# EAGLE design vdg_voltage_sensor_rev2 (EAGLE 9.6.2)
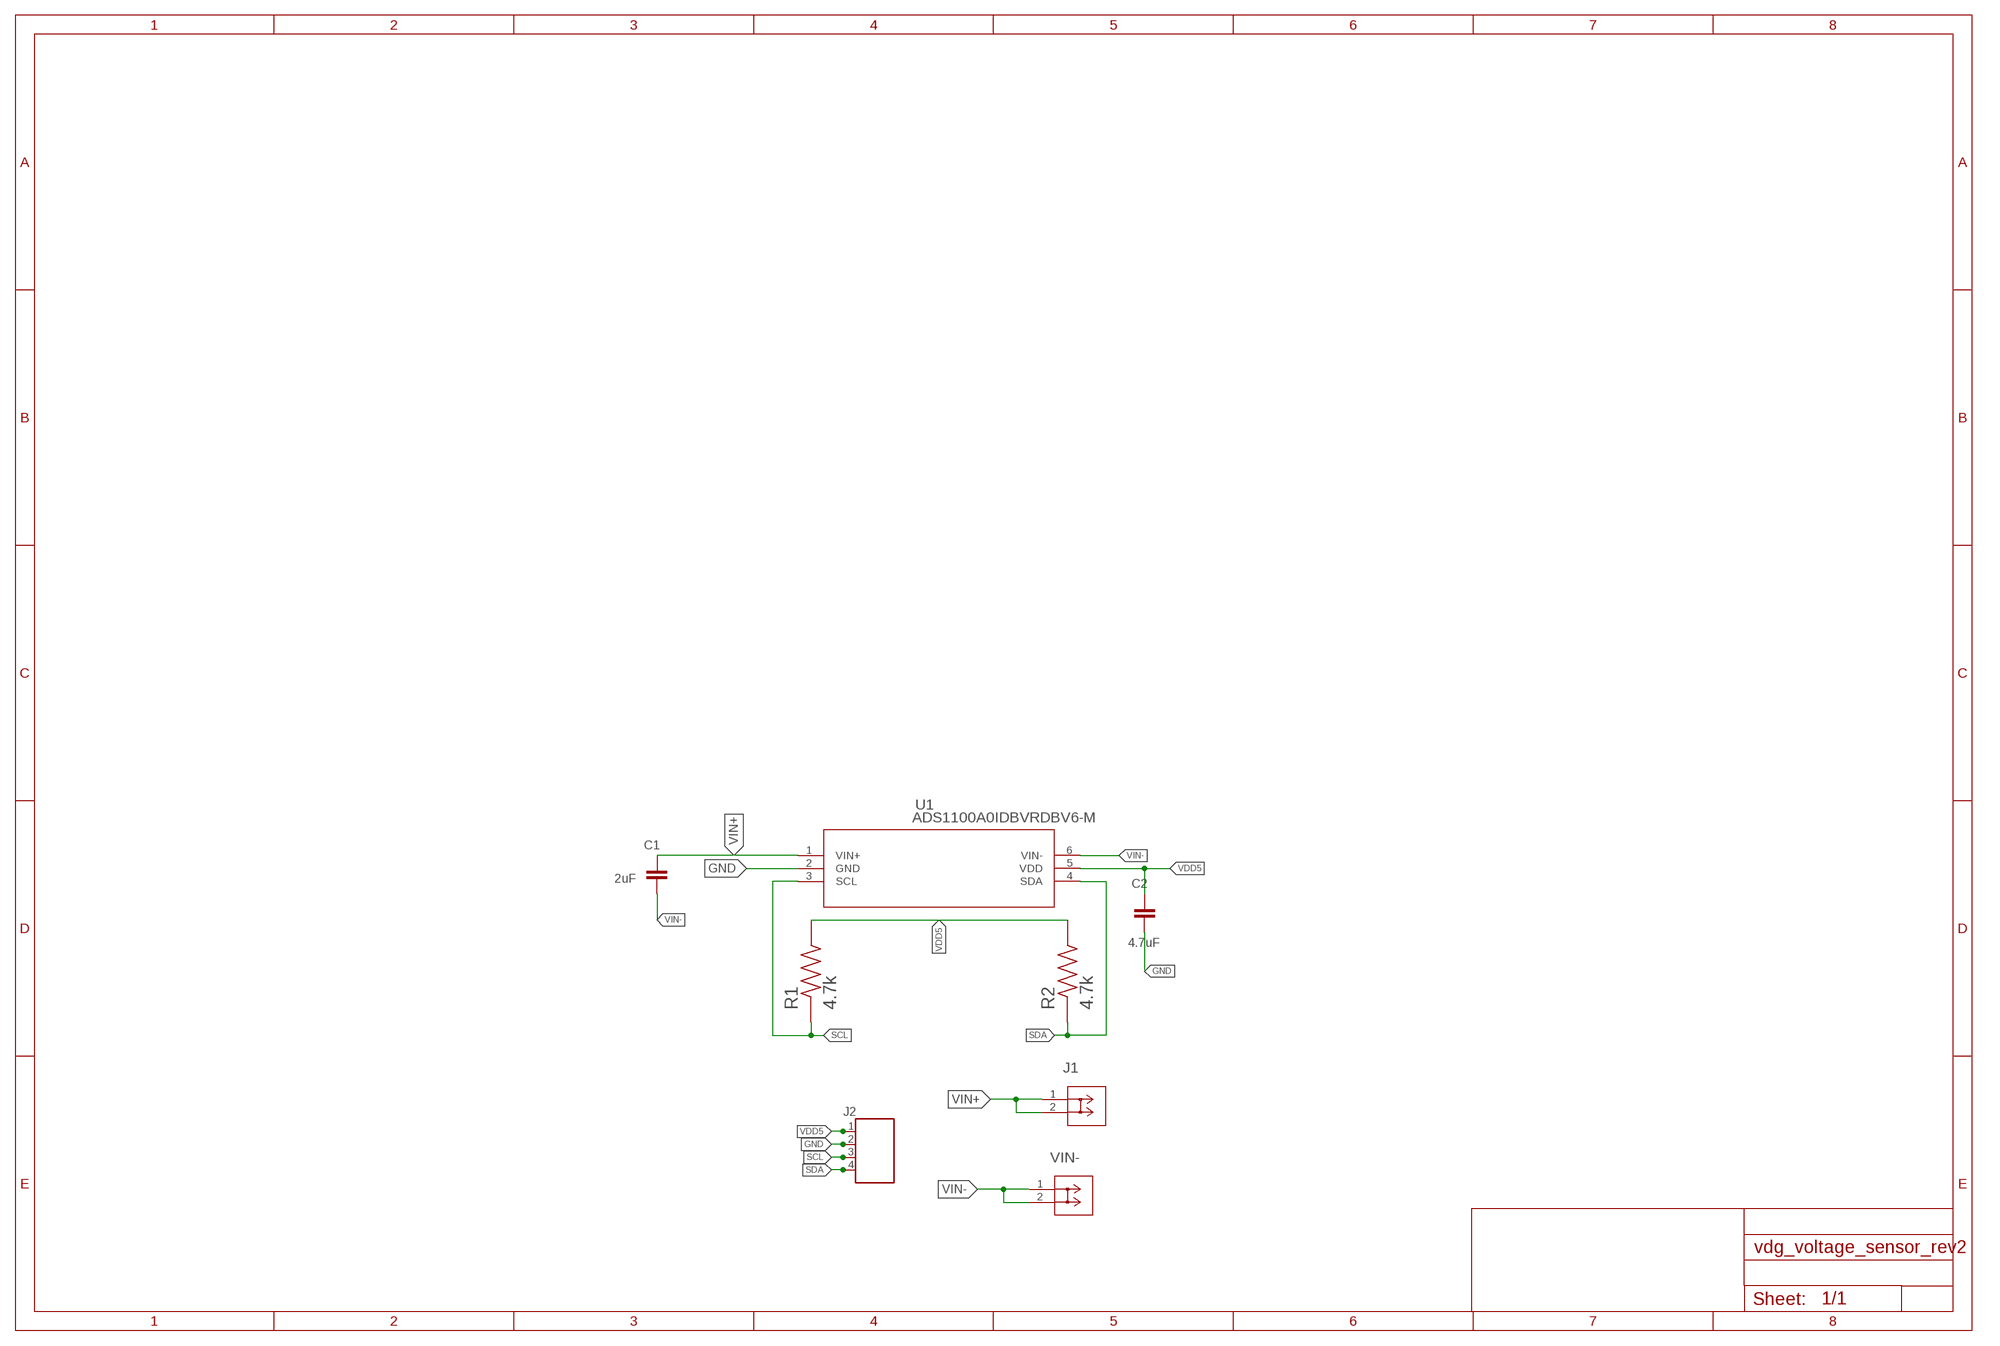
[diagram p0: schematic, sheet 1]

## Parts
C1  2uF  GRM31CR60J107ME39L  [CAP_1206]
C2  4.7uF  GRM31CR60J107ME39L  [CAP_1206]
J1  VANDEGRAAFF  SR99S01VBNN00G7  [SR99S01VBNN00G7_MZC]
J2  691131710004  [691131710004]
R1  4.7k  CRGP1206F120R  [RESC3115X65N]
R2  4.7k  CRGP1206F120R  [RESC3115X65N]
U1  ADS1100A0IDBVRDBV6-M  [DBV6-M]
VIN-  SR99S01VBNN00G7  [SR99S01VBNN00G7_MZC]

## Nets
GND: C2.2 J2.2 U1.2(GND)
SCL: J2.3 R1.1 U1.3(SCL)
SDA: J2.4 R2.1 U1.4(SDA)
VDD5: C2.1 J2.1 R1.2 R2.2 U1.5(VDD)
VIN+: C1.1 J1.1 J1.2 U1.1(VIN+)
VIN-: C1.2 U1.6(VIN-) VIN-.1 VIN-.2

## Library data of the parts
C1 C2 = Resistor_Capacitor:GRM31CR60J107ME39L: CAP CER 100UF 6.3V X5R 1206 Manufacturer's datasheet <https://www.murata.com/~/media/webrenewal/support/library/catalog/products/capacitor/mlcc/c02e.ashx?la=en-us>; CREATED_BY: PCBLayout.com; DIGIKEY_PART_NUMBER: GRM31CR60J107ME39L; MANUFACTURER: Murata Electronics North America; MPN: GRM31CR60J107ME39L; PACKAGE: SMD 1206
J1 VIN- = screwterm_1:SR99S01VBNN00G7; BUILT_BY: EMA_Kyle; COPYRIGHT: Copyright (C) 2018 Accelerated Designs. All rights reserved; MANUFACTURER_PART_NUMBER: SR99S01VBNN00G7; SOURCELIBRARY: Metz_Connect_USA_2019-05-03; VENDOR: Metz Connect USA
J2 = Wurth_Elektronik_Electromechanic_Terminal_Blocks_Connectors_rev16b:691131710004: WR-TBL Terminal block - CUU5/4 - 4 Pins;=>Code : Con_TBL_Screw_PClamp_5.00_6911317100xx_691131710004 <http://katalog.we-online.de/media/images/eican/Con_TBL_Screw_PClamp_5.00_6911317100xx_pf2.jpg> Details see: http://katalog.we-online.de/em/datasheet/6911317100xx.pdf Created 11/3/2014, Karrer Zheng 2014 (C) Wurth Elektronik
R1 R2 = CRGP1206F120R:CRGP1206F120R: Fixed Resistor CRGP 1206 120R 1%; ARROW_ELECTRONICS-PURCHASE-URL: https://snapeda.com/shop?store=Arrow+Electronics&id=3188205; AVAILABILITY: Unavailable; COMMENT: 1-2176328-4; DESCRIPTION: Fixed Resistor CRGP 1206 120R 1%; DIGIKEY-PURCHASE-URL: https://snapeda.com/shop?store=DigiKey&id=3188205; MF: TE Connectivity; MOUSER-PURCHASE-URL: https://snapeda.com/shop?store=Mouser&id=3188205; MP: CRGP1206F120R; PACKAGE: 3115 TE Connectivity; PRICE: None
U1 = ADS1100:ADS1100A0IDBVR; DATASHEET_URL: http://www.ti.com/lit/gpn/ADS1100; DESCRIPTION: Self-Calibrating, 16-Bit Analog-to-Digital Converter; FAMILY_NAME: PRECISION ADC (<=10MSPS); GENERIC_PART_NUMBER: ADS1100; INDUSTRY_STD_PKG_TYPE: SOT-23; MANUFACTURER: Texas Instruments; PACKAGE_DESIGNATOR: DBV; PIN_COUNT: 6

## Board
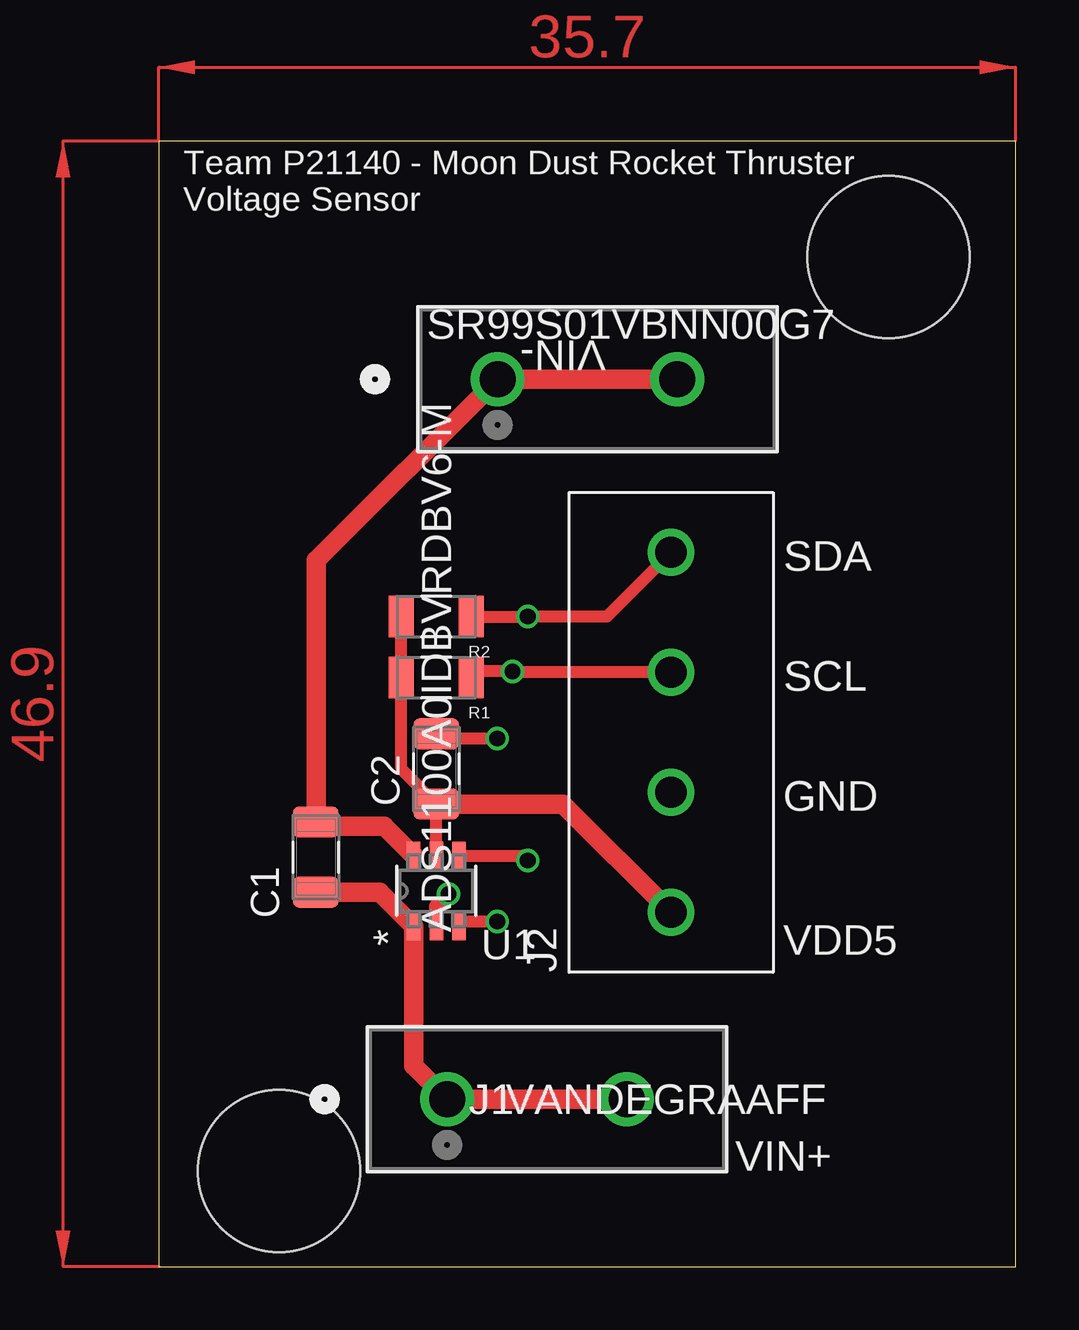
[diagram p1: board, top side]
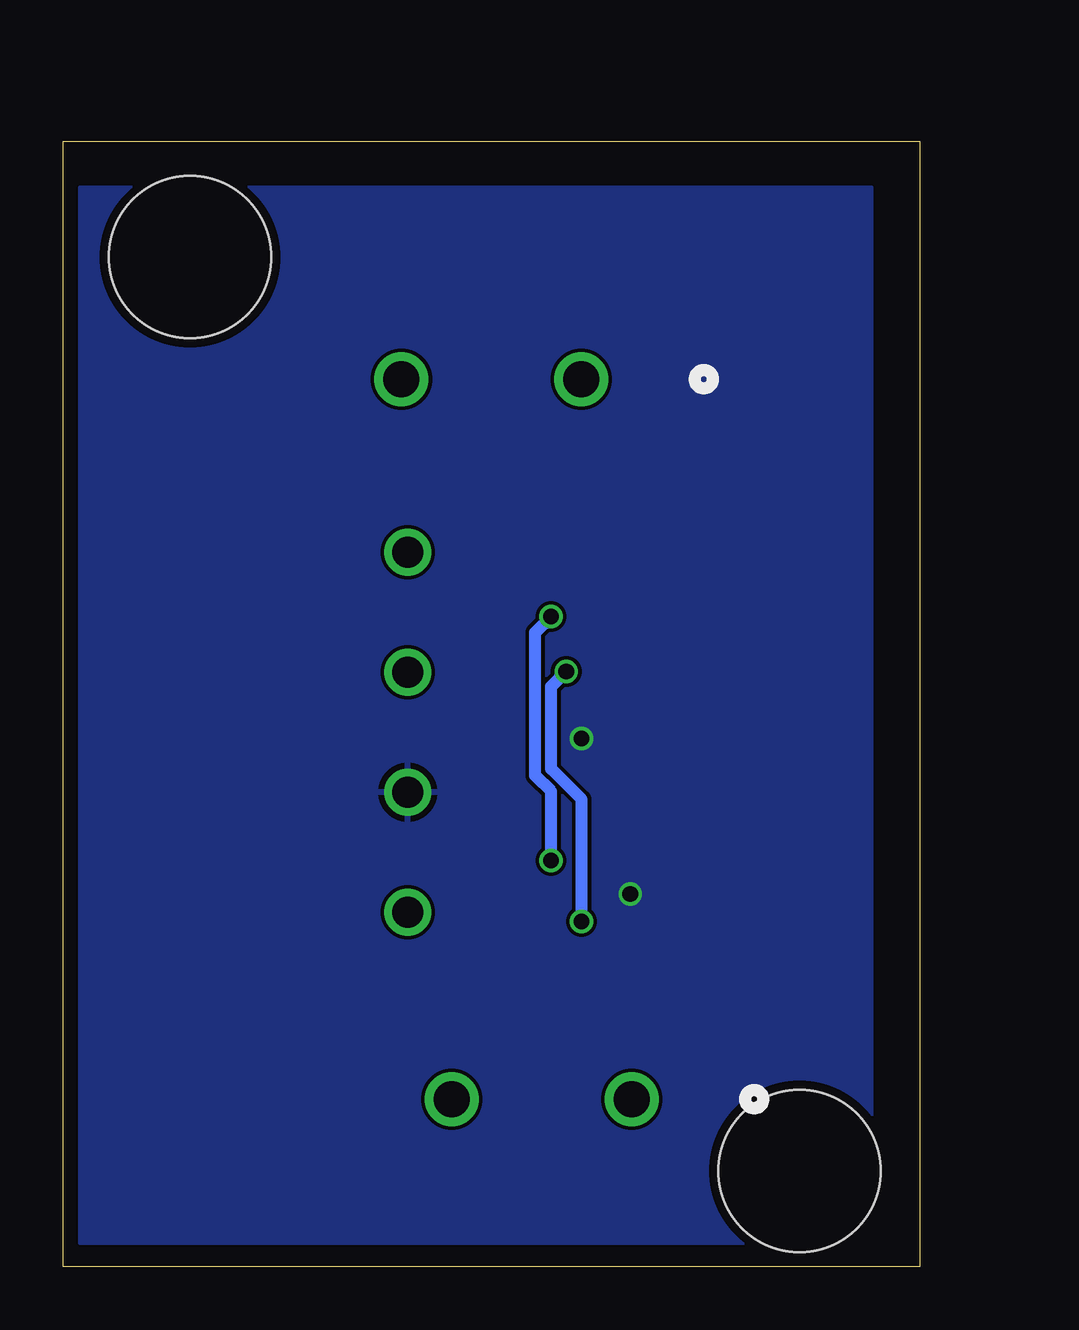
[diagram p2: board, bottom side, seen from below]

Size 35.7 x 46.9 mm. Coordinates in mm from the lower left corner, seen from the top.
Outline: 0,46.9 0,0 35.7,0 35.7,46.9 0,46.9
Copper layers (1*16): Top 0.035559375mm / dielectric 1.6mm / Bottom 0.035559375mm
Design rules "oshpark-2layer": minimum track width 6mil, minimum drill 10mil, track to track 6mil, track to pad 6mil, pad to pad 6mil, via to via 6mil, smd to smd 6mil, copper to edge 15mil, drill to drill 6mil, minimum pad ring 5mil, minimum via ring 5mil, stop-mask expansion 2.5mil, vias tented up to drill 0mil, thermal gap 10mil
Holes 6.76 mm at 5.01,3.98 30.41,42.08

### Footprints (pad centres in the part's own frame; a part is rotated, then mirrored left to right if it is on the bottom)
CAP_1206 = smd 1.29 x 1.91: 1 -1.46,0; 2 1.46,0
SR99S01VBNN00G7_MZC = drill 1.499 pad 2.007: 1 0,0; 2 7.493,0
691131710004 = drill 1.3: 1 -7.5,0; 2 -2.5,0; 3 2.5,0; 4 7.5,0
RESC3115X65N = smd 1.05 x 1.72: 1 -1.46,0; 2 1.46,0
DBV6-M = smd 1.181 x 0.559: 1 -1.467,0.95; 2 -1.467,0; 3 -1.467,-0.95; 4 1.467,-0.95; 5 1.467,0; 6 1.467,0.95

### Placement (x,y rotation side)
C1  3uf  [CAP_1206]  6.54,17.07 90 top
C2  11.56,20.74 90 top
J1  12.01,6.98 0 top
J2  21.34,22.26 90 top
R1  11.56,24.55 180 top
R2  11.56,27.09 180 top
U1  11.56,15.66 90 top
VIN-  14.11,36.98 0 top

### Tracks (layer width: path | path; a pad name or v marks a point on that pad's centre or on a via)
GND  (via drill 0.65)
  Top 0.508: C2.2 11.75,22.01 v14.1,22.01
  Top 0.61: U1.2 11.56,15.03 v12.07,15.53
  pour Bottom: 2.01,0.98 2.01,44.98 35.01,44.98 35.01,0.98
SCL  (via drill 0.65)
  Top 0.508: R1.1 13.27,24.8 v14.73,24.8 14.78,24.76 J2.3 | U1.3 12.71,14.39 v14.1,14.39
  Bottom 0.508: v14.1,14.39 14.1,19.47 15.37,20.74 15.37,24.17 v14.73,24.8
SDA  (via drill 0.65)
  Top 0.508: R2.1 v15.37,27.09 18.67,27.09 J2.4 | U1.4 15.17,17.13 v15.37,16.93
  Bottom 0.508: v15.37,16.93 15.37,19.81 16.03,20.47 16.03,26.43 v15.37,27.09
VDD5
  Top 0.508: U1.5 C2.1 10.1,20.74 R1.2 R2.2
  Top 0.813: C2.1 16.82,19.28 J2.1
VIN+
  Top 0.813: C1.1 9.19,15.61 U1.1 10.61,8.38 J1.1 J1.2
VIN-
  Top 0.813: U1.6 9.38,18.35 6.72,18.35 C1.2 6.56,18.55 6.56,29.43 VIN-.1 VIN-.2
(copper drawn outside any net)
  shapes: Top area x2

### Text on the board
tNames: Team P21140 - Moon Dust Rocket Thruster / Voltage Sensor | SDA | SCL | GND | VDD5 | VIN+